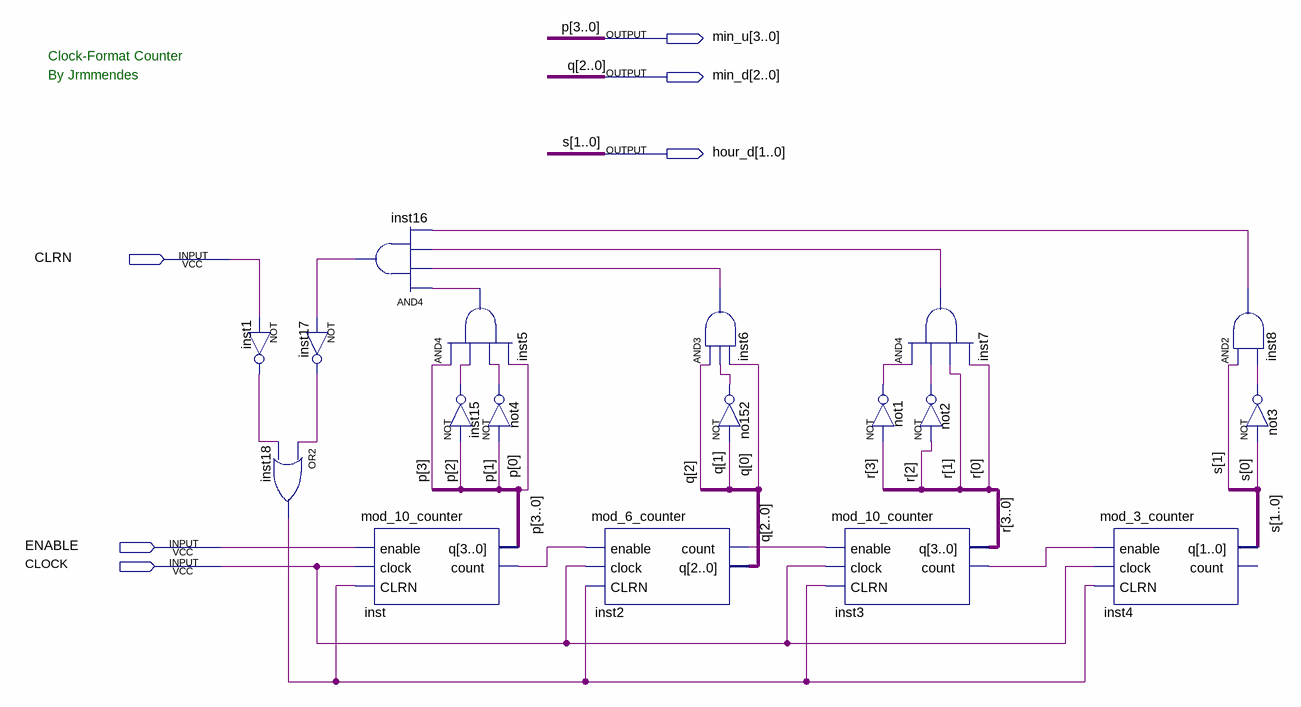
[diagram p0: schematic sheet]
// Quartus schematic clock_format_counter.bdf as structural Verilog: 18 symbols, 6 pins
module clock_format_counter (
  input  CLRN,
  input  ENABLE,
  input  CLOCK,
  output [3:0] min_u,
  output [2:0] min_d,
  output [1:0] hour_d
);

  wire inst1_out, inst2_count, inst3_count, inst5_out, inst6_out, inst7_out, inst8_out, inst15_out,
       inst16_out, inst17_out, inst18_out, inst_count, no152_out, not1_out, not2_out, not3_out, not4_out;
  wire [3:0] r;

  not inst1 (inst1_out, CLRN);
  or inst18 (inst18_out, inst17_out, inst1_out);
  not inst17 (inst17_out, inst16_out);
  and inst16 (inst16_out, inst5_out, inst6_out, inst7_out, inst8_out);
  mod_10_counter inst (.enable(ENABLE), .clock(CLOCK), .CLRN(inst18_out), .q(min_u), .count(inst_count));
  and inst5 (inst5_out, min_u[3], inst15_out, not4_out, min_u[0]);
  not inst15 (inst15_out, min_u[2]);
  not not4 (not4_out, min_u[1]);
  mod_6_counter inst2 (.enable(inst_count), .clock(CLOCK), .CLRN(inst18_out), .count(inst2_count), .q(min_d));
  and inst6 (inst6_out, min_d[2], no152_out, min_d[0]);
  not no152 (no152_out, min_d[1]);
  not not1 (not1_out, r[3]);
  mod_10_counter inst3 (.enable(inst2_count), .clock(CLOCK), .CLRN(inst18_out), .q(r), .count(inst3_count));
  and inst7 (inst7_out, not1_out, not2_out, r[1], r[0]);
  not not2 (not2_out, r[2]);
  mod_3_counter inst4 (.enable(inst3_count), .clock(CLOCK), .CLRN(inst18_out), .q(hour_d));  // open: count
  and inst8 (inst8_out, hour_d[1], not3_out);
  not not3 (not3_out, hour_d[0]);

  // Other names for the same wires on the sheet: p[3:0] = min_u; q[2:0] = min_d; s[1:0] = hour_d

  // Notes on the sheet:
  //   Clock-Format Counter
  //   By Jrmmendes
endmodule
